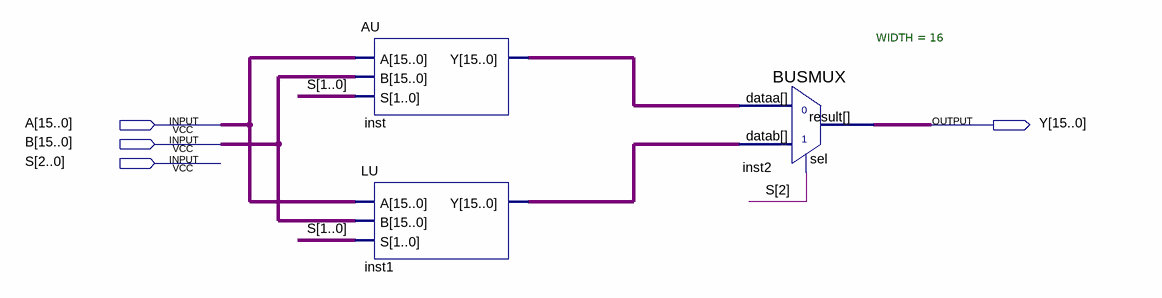
[diagram p0: schematic sheet]
// Quartus schematic ALUbulid.bdf as structural Verilog: 3 symbols, 4 pins
module ALUbulid (
  input  [15:0] A,
  input  [15:0] B,
  input  [2:0] S,
  output [15:0] Y
);

  wire [15:0] inst1_y, inst_y;

  AU inst (.A(A), .B(B), .S(S[1:0]), .Y(inst_y));
  LU inst1 (.A(A), .S(S[1:0]), .B(B), .Y(inst1_y));
  BUSMUX #(.WIDTH(16)) inst2 (.datab(inst1_y), .sel(S[2]), .dataa(inst_y), .result(Y));
endmodule
